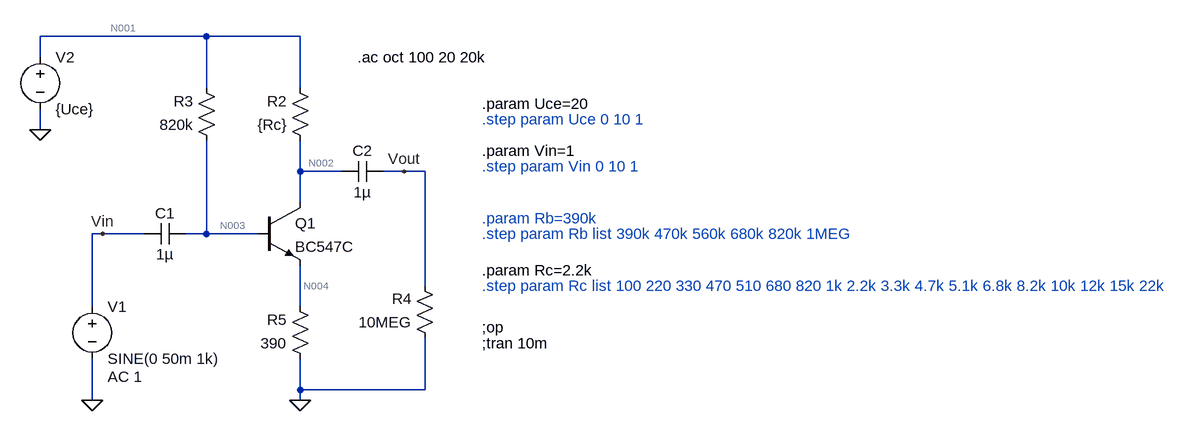
[diagram p0: schematic 6_amplifier-av.asc]
6_amplifier-av.asc, the LTspice schematic file:
Version 4
SHEET 1 2040 680
WIRE 400 -256 144 -256
WIRE 544 -256 400 -256
WIRE 144 -224 144 -256
WIRE 400 -176 400 -256
WIRE 544 -176 544 -256
WIRE 144 -112 144 -144
WIRE 544 -48 544 -96
WIRE 608 -48 544 -48
WIRE 704 -48 672 -48
WIRE 736 -48 704 -48
WIRE 544 0 544 -48
WIRE 240 48 224 48
WIRE 304 48 240 48
WIRE 400 48 400 -96
WIRE 400 48 368 48
WIRE 480 48 400 48
WIRE 736 128 736 -48
WIRE 224 160 224 48
WIRE 544 160 544 96
WIRE 544 288 544 240
WIRE 736 288 736 208
WIRE 736 288 544 288
WIRE 224 304 224 240
WIRE 544 304 544 288
FLAG 544 304 0
FLAG 144 -112 0
FLAG 224 304 0
FLAG 704 -48 Vout
FLAG 240 48 Vin
SYMBOL npn3 480 0 R0
SYMATTR InstName Q1
SYMATTR Value BC547C
SYMBOL res 560 -80 R180
WINDOW 0 36 76 Left 2
WINDOW 3 36 40 Left 2
SYMATTR InstName R2
SYMATTR Value {Rc}
SYMBOL voltage 144 -240 R0
WINDOW 123 0 0 Left 2
WINDOW 39 0 0 Left 2
SYMATTR InstName V2
SYMATTR Value {Uce}
SYMBOL res 416 -80 R180
WINDOW 0 36 76 Left 2
WINDOW 3 36 40 Left 2
SYMATTR InstName R3
SYMATTR Value 820k
SYMBOL cap 672 -64 R90
WINDOW 0 0 32 VBottom 2
WINDOW 3 32 32 VTop 2
SYMATTR InstName C2
SYMATTR Value 1µ
SYMBOL res 752 224 R180
WINDOW 0 36 76 Left 2
WINDOW 3 36 40 Left 2
SYMATTR InstName R4
SYMATTR Value 10MEG
SYMBOL res 560 256 R180
WINDOW 0 36 76 Left 2
WINDOW 3 36 40 Left 2
SYMATTR InstName R5
SYMATTR Value 390
SYMBOL cap 368 32 R90
WINDOW 0 0 32 VBottom 2
WINDOW 3 32 32 VTop 2
SYMATTR InstName C1
SYMATTR Value 1µ
SYMBOL voltage 224 144 R0
WINDOW 123 24 124 Left 2
WINDOW 39 0 0 Left 2
SYMATTR Value2 AC 1
SYMATTR InstName V1
SYMATTR Value SINE(0 50m 1k)
TEXT 824 192 Left 2 !;op
TEXT 824 -128 Left 2 ;.step param Uce 0 10 1
TEXT 824 216 Left 2 !;tran 10m
TEXT 824 -152 Left 2 !.param Uce=20
TEXT 824 -56 Left 2 ;.step param Vin 0 10 1
TEXT 824 48 Left 2 ;.step param Rb list 390k 470k 560k 680k 820k 1MEG
TEXT 824 -80 Left 2 !.param Vin=1
TEXT 824 104 Left 2 !.param Rc=2.2k
TEXT 824 128 Left 2 ;.step param Rc list 100 220 330 470 510 680 820 1k 2.2k 3.3k 4.7k 5.1k 6.8k 8.2k 10k 12k 15k 22k
TEXT 824 24 Left 2 ;.param Rb=390k
TEXT 632 -224 Left 2 !.ac oct 100 20 20k

The netlist it stands for:
* 6_amplifier-av.asc
Q1 N002 N003 N004 0 BC547C
R2 N002 N001 {Rc}
V2 N001 0 {Uce}
R3 N003 N001 820k
C2 Vout N002 1µ
R4 0 Vout 10MEG
R5 0 N004 390
C1 N003 Vin 1µ
V1 Vin 0 SINE(0 50m 1k) AC 1
.model NPN NPN
.model PNP PNP
.lib standard.bjt
;op
* .step param Uce 0 10 1
;tran 10m
.param Uce=20
* .step param Vin 0 10 1
* .step param Rb list 390k 470k 560k 680k 820k 1MEG
.param Vin=1
.param Rc=2.2k
* .step param Rc list 100 220 330 470 510 680 820 1k 2.2k 3.3k 4.7k 5.1k 6.8k 8.2k 10k 12k 15k 22k
* .param Rb=390k
.ac oct 100 20 20k
.backanno
.end

* Results of the author's LTspice run, read from the files saved beside the schematic
* Operating Point, zero values left out:
*   V(n002) = 3.162 V
*   V(n003) = 3.671 V
*   V(n004) = 2.993 V
*   V(n001) = 20 V
*   Ic(Q1) = 7.654 mA
*   Ib(Q1) = 19.91 µA
*   Ie(Q1) = -7.674 mA
*   I(R5) = -7.674 mA
*   I(R3) = -19.91 µA
*   I(R2) = -7.654 mA
*   I(V2) = -7.674 mA
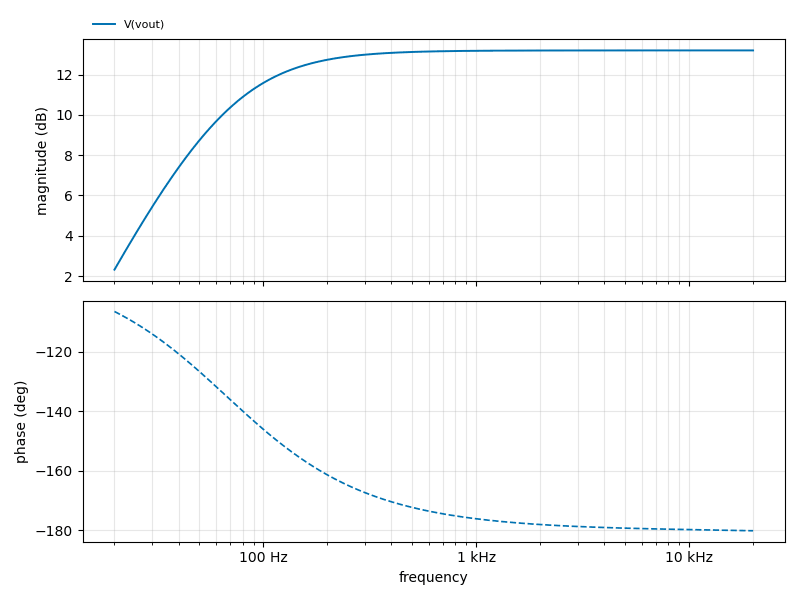
[diagram p1: AC Analysis of 6_amplifier-av.asc, plotted from the saved traces]
* AC Analysis, 1 run:
*   V(vout): 2.31 dB at 20 Hz, 13.21 dB at 20 kHz, peak 13.21 dB at 15.74 kHz, 3 dB below the peak at 67.19 Hz